# EasyEDA Pro project 学期项目.epro, board PCB4
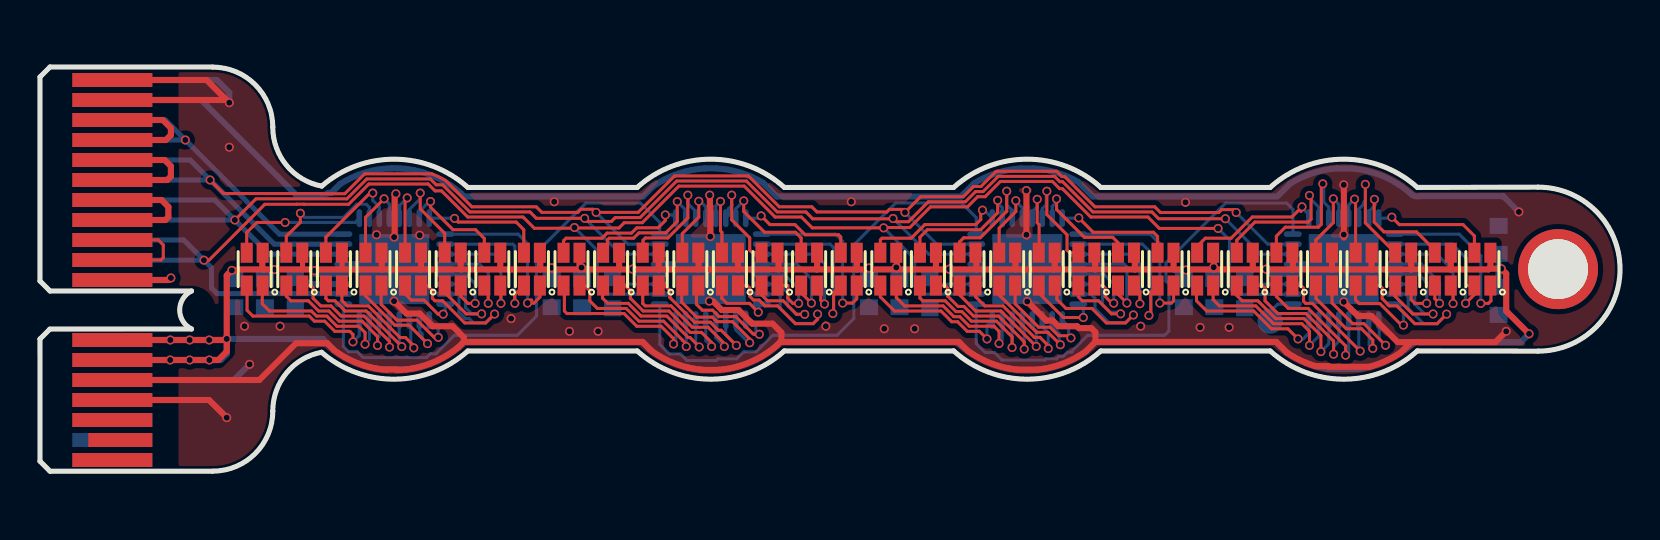
[diagram p9: board, top side]
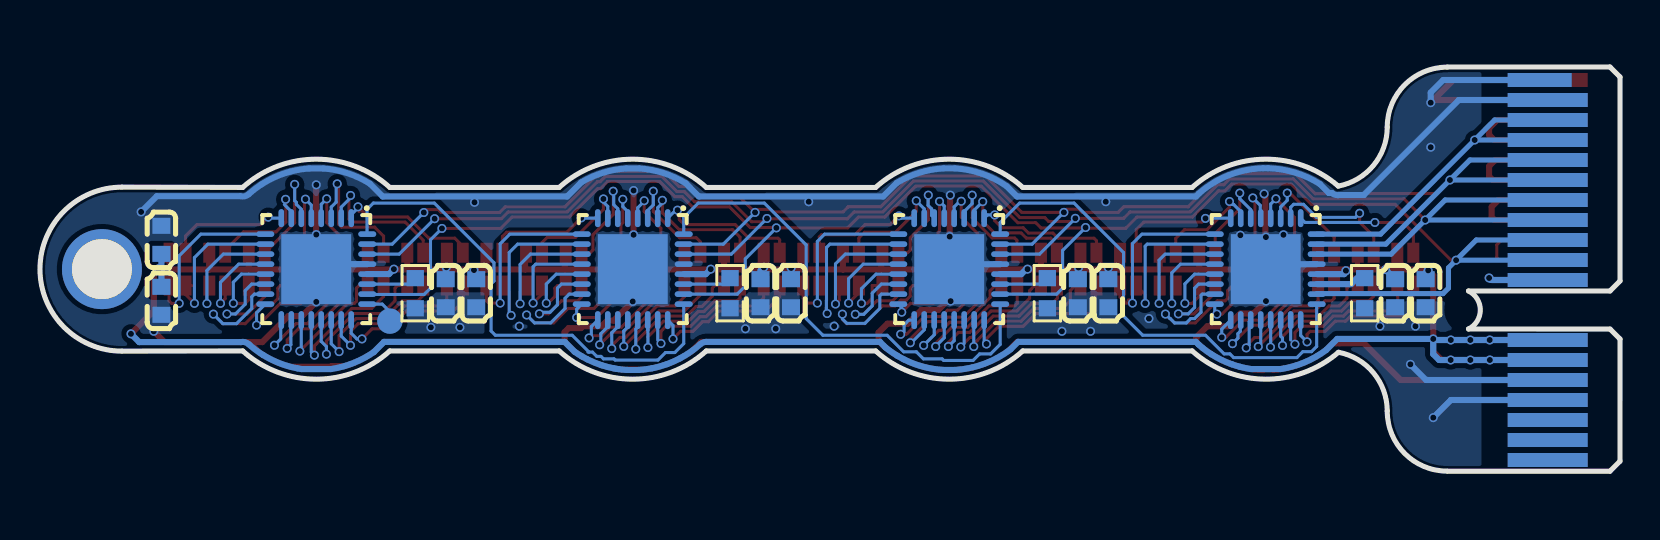
[diagram p10: board, bottom side, seen from below]

Outline 79.05 x 20.21 mm; copper layers: Top Layer, Bottom Layer. Coordinates in mm from the lower left corner of the outline.
Outline path: 8.65,20.2 arc(10.77,19.33) 11.65,17.2 arc(12.33,15.3) 14.1,14.26 arc(17.77,15.6) 21.41,14.19 29.88,14.19 arc(33.56,15.6) 37.24,14.19 45.71,14.19 arc(49.39,15.6) 53.07,14.19 61.54,14.19 arc(65.22,15.6) 68.9,14.19 74.95,14.2 arc(79.05,10.1) 74.95,6 68.9,6.02 arc(65.22,4.6) 61.54,6.02 53.07,6.02 arc(49.39,4.6) 45.71,6.02 37.24,6.02 arc(33.56,4.6) 29.88,6.02 21.41,6.02 arc(17.77,4.6) 14.09,5.95 arc(12.32,4.9) 11.65,3 arc(10.77,0.88) 8.65,0
Stack: Top Layer 0.035mm / Dielectric1 1.51mm FR4 er 4.5 / Bottom Layer 0.035mm

## Design rules (mm)
spacing copperThickness1oz (default): track to track 0.102, other pairs 0.152 to 0.3
spacing copperThickness2oz: track to track 0.203, other pairs 0.152 to 0.3
track width copperThickness1oz (default): min 0.127, default 0.254, max 2.54
track width copperThickness2oz: min 0.203, default 0.254, max 2.54
differential pair differentialPair (default): width min 0.127, default 0.254, max 2.54; gap min 0.152, default 0.152
net GND uses copperRegion

## Placement (name value [footprint] x y rotation side)
C1  10uF  [C0603]  27.12 8.9 90 bottom
C2  10uF  [C0603]  25.6 8.9 90 bottom
C3  100nF  [C0603]  43 8.9 90 bottom
C4  100nF  [C0603]  41.47 8.9 90 bottom
C5  10uF  [C0603]  57.22 8.9 90 bottom
C6  10uF  [C0603]  58.75 8.9 90 bottom
C7  100nF  [C0603]  9.72 8.9 90 bottom
C8  100nF  [C0603]  11.25 8.9 90 bottom
C9  10uF  [C0603]  72.97 8.52 90 bottom
C10  10uF  [C0603]  72.97 11.57 270 bottom
CEM1  PCIEX16_GOLD  [CEMFULLx16]  3.63 13.26 270 top
LED1  LTST-C19HE1WT-H  [LED-ARRAY-SMD_0603-4P-L1.6-W1.6-BL-RD]  10.74 10.1 90 top
LED2  LTST-C19HE1WT-H  [LED-ARRAY-SMD_0603-4P-L1.6-W1.6-BL-RD]  12.72 10.1 90 top
LED3  LTST-C19HE1WT-H  [LED-ARRAY-SMD_0603-4P-L1.6-W1.6-BL-RD]  14.7 10.1 90 top
LED4  LTST-C19HE1WT-H  [LED-ARRAY-SMD_0603-4P-L1.6-W1.6-BL-RD]  16.69 10.1 90 top
LED5  LTST-C19HE1WT-H  [LED-ARRAY-SMD_0603-4P-L1.6-W1.6-BL-RD]  18.67 10.1 90 top
LED6  LTST-C19HE1WT-H  [LED-ARRAY-SMD_0603-4P-L1.6-W1.6-BL-RD]  20.65 10.1 90 top
LED7  LTST-C19HE1WT-H  [LED-ARRAY-SMD_0603-4P-L1.6-W1.6-BL-RD]  22.63 10.1 90 top
LED8  LTST-C19HE1WT-H  [LED-ARRAY-SMD_0603-4P-L1.6-W1.6-BL-RD]  24.61 10.1 90 top
LED9  LTST-C19HE1WT-H  [LED-ARRAY-SMD_0603-4P-L1.6-W1.6-BL-RD]  26.59 10.1 90 top
LED10  LTST-C19HE1WT-H  [LED-ARRAY-SMD_0603-4P-L1.6-W1.6-BL-RD]  28.57 10.1 90 top
LED11  LTST-C19HE1WT-H  [LED-ARRAY-SMD_0603-4P-L1.6-W1.6-BL-RD]  30.55 10.1 90 top
LED12  LTST-C19HE1WT-H  [LED-ARRAY-SMD_0603-4P-L1.6-W1.6-BL-RD]  32.53 10.1 90 top
LED13  LTST-C19HE1WT-H  [LED-ARRAY-SMD_0603-4P-L1.6-W1.6-BL-RD]  34.52 10.1 90 top
LED14  LTST-C19HE1WT-H  [LED-ARRAY-SMD_0603-4P-L1.6-W1.6-BL-RD]  36.5 10.1 90 top
LED15  LTST-C19HE1WT-H  [LED-ARRAY-SMD_0603-4P-L1.6-W1.6-BL-RD]  38.48 10.1 90 top
LED16  LTST-C19HE1WT-H  [LED-ARRAY-SMD_0603-4P-L1.6-W1.6-BL-RD]  40.46 10.1 90 top
LED17  LTST-C19HE1WT-H  [LED-ARRAY-SMD_0603-4P-L1.6-W1.6-BL-RD]  42.44 10.1 90 top
LED18  LTST-C19HE1WT-H  [LED-ARRAY-SMD_0603-4P-L1.6-W1.6-BL-RD]  44.42 10.1 90 top
LED19  LTST-C19HE1WT-H  [LED-ARRAY-SMD_0603-4P-L1.6-W1.6-BL-RD]  46.4 10.1 90 top
LED20  LTST-C19HE1WT-H  [LED-ARRAY-SMD_0603-4P-L1.6-W1.6-BL-RD]  48.39 10.1 90 top
LED21  LTST-C19HE1WT-H  [LED-ARRAY-SMD_0603-4P-L1.6-W1.6-BL-RD]  50.37 10.1 90 top
LED22  LTST-C19HE1WT-H  [LED-ARRAY-SMD_0603-4P-L1.6-W1.6-BL-RD]  52.35 10.1 90 top
LED23  LTST-C19HE1WT-H  [LED-ARRAY-SMD_0603-4P-L1.6-W1.6-BL-RD]  54.33 10.1 90 top
LED24  LTST-C19HE1WT-H  [LED-ARRAY-SMD_0603-4P-L1.6-W1.6-BL-RD]  56.31 10.1 90 top
LED25  LTST-C19HE1WT-H  [LED-ARRAY-SMD_0603-4P-L1.6-W1.6-BL-RD]  58.29 10.1 90 top
LED26  LTST-C19HE1WT-H  [LED-ARRAY-SMD_0603-4P-L1.6-W1.6-BL-RD]  60.27 10.1 90 top
LED27  LTST-C19HE1WT-H  [LED-ARRAY-SMD_0603-4P-L1.6-W1.6-BL-RD]  62.25 10.1 90 top
LED28  LTST-C19HE1WT-H  [LED-ARRAY-SMD_0603-4P-L1.6-W1.6-BL-RD]  64.24 10.1 90 top
LED29  LTST-C19HE1WT-H  [LED-ARRAY-SMD_0603-4P-L1.6-W1.6-BL-RD]  66.22 10.1 90 top
LED30  LTST-C19HE1WT-H  [LED-ARRAY-SMD_0603-4P-L1.6-W1.6-BL-RD]  68.2 10.1 90 top
LED31  LTST-C19HE1WT-H  [LED-ARRAY-SMD_0603-4P-L1.6-W1.6-BL-RD]  70.18 10.1 90 top
LED32  LTST-C19HE1WT-H  [LED-ARRAY-SMD_0603-4P-L1.6-W1.6-BL-RD]  72.16 10.1 90 top
NOREF  -  [Pad_e200]  75.95 10.1 0 top
NOREF#2  -  [Pad_e1118]  61.54 7.5 0 top
R1  10K  [R0603]  28.65 8.9 270 bottom
R2  10K  [R0603]  12.77 8.9 270 bottom
R3  10K  [R0603]  44.52 8.9 270 bottom
R4  10K  [R0603]  60.27 8.9 270 bottom
U1  TLC5947RHBR  [VFQFN-32_L5.0-W5.0-P0.50-TL-EP3.5]  17.73 10.1 270 bottom
U2  TLC5947RHBR  [VFQFN-32_L5.0-W5.0-P0.50-TL-EP3.5]  33.56 10.1 270 bottom
U3  TLC5947RHBR  [VFQFN-32_L5.0-W5.0-P0.50-TL-EP3.5]  49.39 10.1 270 bottom
U4  TLC5947RHBR  [VFQFN-32_L5.0-W5.0-P0.50-TL-EP3.5]  65.22 10.1 270 bottom

## Footprints (pads in the part's own frame, mm; a bottom-side part is the same pattern mirrored in y, then rotated)
C0603
  rect 0.8x0.9 smd: 1(-0.7,0) 2(0.7,0)
CEMFULLx16
  rect 0.7x3.2 smd far side: A1(-6.297,0.39)
  rect 0.7x4 smd far side: A2(-5.297,-0.01) A3(-4.297,-0.01) A4(-3.297,-0.01) A5(-2.297,-0.01) A6(-1.297,-0.01) A7(-0.297,-0.01) A8(0.703,-0.01) A9(1.703,-0.01) A10(2.703,-0.01) A11(3.703,-0.01) A12(6.703,-0.01) A13(7.703,-0.01) A14(8.703,-0.01) A15(9.703,-0.01) A16(10.703,-0.01) A17(11.703,-0.01) A18(12.703,-0.01)
  rect 0.7x4 smd: B1(-6.297,-0.01) B2(-5.297,-0.01) B3(-4.297,-0.01) B4(-3.297,-0.01) B5(-2.297,-0.01) B6(-1.297,-0.01) B7(-0.297,-0.01) B8(0.703,-0.01) B9(1.703,-0.01) B10(2.703,-0.01) B11(3.703,-0.01) B12(6.703,-0.01) B13(7.703,-0.01) B14(8.703,-0.01) B15(9.703,-0.01) B16(10.703,-0.01) B18(12.703,-0.01)
  rect 0.7x3.2 smd: B17(11.703,0.39)
LED-ARRAY-SMD_0603-4P-L1.6-W1.6-BL-RD
  rect 1x0.6 smd: 1(-0.82,-0.4) 2(-0.82,0.4) 3(0.82,0.4) 4(0.82,-0.4)
Pad_e200
  round 4 hole 3: 1(0,0)
Pad_e1118
  round 1.27 smd far side: 1(0,0)
R0603
  rect 0.806x0.864 smd: 1(-0.753,0) 2(0.753,0)
VFQFN-32_L5.0-W5.0-P0.50-TL-EP3.5
  oval 0.9x0.28 smd: 1(-2.55,1.75) 2(-2.55,1.25) 3(-2.55,0.75) 4(-2.55,0.249) 5(-2.55,-0.249) 6(-2.55,-0.75) 7(-2.55,-1.25) 8(-2.55,-1.75) 17(2.55,-1.75) 18(2.55,-1.25) 19(2.55,-0.75) 20(2.55,-0.249) 21(2.55,0.249) 22(2.55,0.75) 23(2.55,1.25) 24(2.55,1.75)
  oval 0.28x0.9 smd: 9(-1.75,-2.55) 10(-1.25,-2.55) 11(-0.75,-2.55) 12(-0.249,-2.55) 13(0.249,-2.55) 14(0.75,-2.55) 15(1.25,-2.55) 16(1.75,-2.55) 25(1.75,2.55) 26(1.25,2.55) 27(0.75,2.55) 28(0.249,2.55) 29(-0.249,2.55) 30(-0.75,2.55) 31(-1.25,2.55) 32(-1.75,2.55)
  rect 3.5x3.5 smd: 33(0.001,-0.001)

## Nets
As in the schematic.

Pads without a net: CEM1 A16 A17 A18 B16 B17 B18; NOREF 1; NOREF#2 1; U4 25

## Via types
v1: diameter 0.45, hole 0.305, Top Layer to Bottom Layer, 159 vias
v2: diameter 0.45, hole 0.3, Top Layer to Bottom Layer, 6 vias

## Routing (per net, layer and track width the routed paths; a pad name or vN(x,y) marks a point on that pad's centre or on a via; arc(x,y) is an arc through that point)
GND: length 222.1
  Top Layer w0.305: 52.8,6.47 61.85,6.47 62.39,5.92 arc(62.85,5.65) 63.34,5.42 arc(63.57,5.33) 63.82,5.25 64.46,5.25 64.49,5.22 66.52,5.22 arc(67.32,5.51) 68.05,5.92 68.59,6.46 ; 52.8,6.47 52.33,6 arc(52.13,5.86) 51.92,5.73 arc(51.06,5.34) 50.15,5.11 arc(50.03,5.1) 49.92,5.08 48.87,5.08 arc(47.57,5.39) 46.4,6.04 45.97,6.47 37.05,6.47 ; 52.8,6.47 52.8,6.95 52.6,7.16 51.98,7.16 51.88,7.25 50.95,7.25 50.66,7.53 50.35,7.53 v1(49.39,8.49) ; v1(33.49,8.5) 33.67,8.5 34.11,8.06 34.95,8.06 35.63,7.38 36.65,7.38 37.09,6.93 37.09,6.51 37.05,6.47 ; CEM1.B1 8.34,19.56 9.34,18.56 CEM1.A2 ; 21.2,6.47 20.95,6.22 arc(20.45,5.86) 19.91,5.55 arc(19.73,5.47) 19.54,5.39 arc(19.13,5.25) 18.7,5.15 arc(18.52,5.12) 18.33,5.09 arc(18.09,5.07) 17.85,5.06 ; 21.2,6.47 21.2,6.7 20.65,7.25 19.63,7.25 19,7.89 18.33,7.89 v1(17.71,8.51) ; 21.2,6.47 30.15,6.47 30.62,6 arc(31.46,5.51) 32.39,5.19 arc(32.7,5.13) 33.03,5.08 arc(33.1,5.08) 33.16,5.07 33.95,5.07 arc(35.52,5.45) 36.88,6.3 37.05,6.47 ; CEM1.A15 8.46,3.56 v1(9.34,2.68) ; v1(17.81,13.87) 17.74,13.81 17.74,11.73 v1(17.72,11.71) ; v1(65.22,8.47) 65.93,7.76 66.62,7.76 67.92,6.46 68.81,6.46 arc(68.9,6.47) 69,6.46 72.81,6.46 v1(73.35,7) ; v1(49.35,14.04) v1(49.35,11.82) ; v1(33.54,11.73) 33.54,13.25 33.51,13.27 33.51,13.79 v1(33.5,13.8) ; v1(65.22,14.32) 65.23,14.31 65.23,11.69 ; CEM1.A14 10.97,4.56 12.81,6.4 14.04,6.4 arc(14.12,6.4) 14.19,6.4 14.37,6.4 14.72,6.04 arc(15.43,5.61) 16.19,5.29 arc(16.34,5.25) 16.49,5.21 arc(16.64,5.17) 16.79,5.14 arc(16.96,5.11) 17.12,5.09 arc(17.24,5.08) 17.36,5.07 ; 17.85,5.09 17.36,5.09
  Bottom Layer w0.305: v1(9.34,2.68) 8.46,3.56 CEM1.A15 ; v1(9.47,18.43) 9.47,18.93 8.84,19.56 4.02,19.56 ; U2.29 33.31,10.35 U2.33 ; U4.29 64.97,10.35 U4.33 ; U1.29 17.48,10.35 U1.33 ; v1(73.99,12.97) 73.2,13.75 69.02,13.75 arc(68.8,13.75) 68.6,13.85 arc(68.29,14.11) 67.97,14.34 arc(67.27,14.72) 66.52,14.98 arc(66.05,15.08) 65.58,15.14 64.87,15.14 arc(63.66,14.9) 62.54,14.37 61.9,13.74 52.67,13.74 51.97,14.44 arc(50.88,14.93) 49.71,15.14 49.07,15.14 arc(47.86,14.91) 46.74,14.4 46.08,13.74 36.86,13.74 36.19,14.41 arc(35.06,14.92) 33.84,15.14 33.28,15.14 arc(31.92,14.88) 30.68,14.25 30.17,13.74 21.22,13.74 21.07,13.88 arc(19.57,14.8) 17.85,15.15 arc(17.73,15.15) 17.6,15.15 arc(16.25,14.93) 15.01,14.36 14.57,13.91 14.41,13.91 arc(14.23,13.82) 14.03,13.81 12.82,13.81 8.07,18.56 CEM1.A2 ; CEM1.A14 9.7,4.56 v1(10.49,5.35)
  vias: v1(9.47,16.2) v1(10.23,7.25) v1(12.01,7.25) v1(16.84,11.82) v1(19,11.8) v1(23.57,7.63) v1(25.73,13.47) v1(26.49,7) v1(27.92,7) v1(39.32,7.25) v1(40.59,13.47) v1(42.24,7.12) v1(43.76,7.12) v1(55.06,7.25) v1(57.31,13.45) v1(58.04,7.19) v1(59.49,7.19) v1(65.22,11.83)
(no net): length 1.8
  Bottom Layer w0.152: U4.25 61.92,8.35 61.54,7.97 NOREF#2.1
BLANK: length 86.9
  Top Layer w0.152: v1(59.3,12.63) 55.96,12.63 55.62,12.96 52.67,12.96 51.16,14.48 51.02,14.48 50.76,14.74 47.94,14.74 47.18,13.98 46.81,13.98 46.3,13.47 44.45,13.47 43.45,12.48 42.84,12.48 ; v1(42.68,12.64) 42.66,12.62 38.66,12.62 38.31,12.97 36.88,12.97 35.34,14.51 31.85,14.51 30.02,12.68 28.78,12.68 28.59,12.49 27.41,12.49 v1(27.25,12.64) 24.83,12.64 24.51,12.97 21.5,12.97 20.15,14.32 19.82,14.32 19.53,14.62 16.35,14.62 15.35,13.62 10.81,13.62 v1(9.75,12.56)
  Bottom Layer w0.152: v1(59.3,12.63) 61.07,10.85 U4.30 ; v1(27.25,12.64) 29.04,10.85 U2.30 ; v1(42.68,12.64) 44.46,10.85 U3.30
  Bottom Layer w0.254: U1.30 11.46,10.85 v1(9.75,12.56) ; v1(9.75,12.56) 8.75,13.56 CEM1.A7 ; v1(9.75,12.56) CEM1.A8
DATA: length 17.6
  Bottom Layer w0.254: CEM1.A4 v1(7.27,16.56) ; v1(7.27,16.56) 6.27,17.56 CEM1.A3 ; v1(7.27,16.56) 11.98,11.85 U1.32
IO3: length 86.1
  Top Layer w0.152: v1(8.51,14.56) 9.19,13.88 14.04,13.88 14.05,13.87 15.25,13.87 16.24,14.87 19.6,14.87 arc(19.95,14.72) 20.29,14.54 21.61,13.22 24.83,13.22 25.11,12.94 26.91,12.94 27.06,13.1 27.67,13.1 v1(27.82,12.94) 29.93,12.94 31.75,14.77 35.44,14.77 36.99,13.22 38.61,13.22 38.87,12.97 42.36,12.97 42.49,13.09 43.12,13.09 v1(43.27,12.94) 44.06,13.73 46.19,13.73 46.7,14.24 47.07,14.24 47.82,14.98 arc(47.85,14.99) 47.88,15 50.86,15 51.13,14.73 51.27,14.73 52.78,13.22 55.77,13.22 56.05,12.94 58.97,12.94 59.12,13.08 59.7,13.08 v1(59.84,12.94)
  Bottom Layer w0.152: U3.31 44.86,11.35 v1(43.27,12.94) ; U2.31 29.41,11.35 v1(27.82,12.94) ; U4.31 61.43,11.35 v1(59.84,12.94)
  Bottom Layer w0.254: CEM1.A5 7.51,15.56 v1(8.51,14.56) ; U1.31 11.72,11.35 v1(8.51,14.56) ; v1(8.51,14.56) CEM1.A6
IO7: length 6.5
  Top Layer w0.305: CEM1.B4 6.3,16.56 6.55,16.82 6.55,17.16 6.14,17.56 CEM1.B3
IO9: length 6.6
  Top Layer w0.305: CEM1.B6 6.37,14.56 6.55,14.74 6.55,15.25 6.24,15.56 CEM1.B5
IO11: length 94.8
  Top Layer w0.152: v1(58.94,12.14) 56,12.14 55.43,12.71 52.57,12.71 51.15,14.13 51.01,14.13 50.65,14.49 48.05,14.49 47.28,13.73 46.91,13.73 46.4,13.22 44.55,13.22 43.52,12.18 42.22,12.18 v1(42.21,12.17) 38.64,12.17 38.09,12.71 36.78,12.71 35.23,14.26 31.96,14.26 30.13,12.43 29.23,12.43 28.96,12.16 26.76,12.16 v1(26.74,12.19) ; v1(8.2,10.55) 8.45,10.55 11.25,13.35 12.83,13.35 12.84,13.35 13.21,13.35 13.22,13.35 15.44,13.35 16.45,14.36 19.42,14.36 19.77,14.02 20.09,14.02 21.4,12.71 24.17,12.71 24.73,12.15 26.74,12.15
  Bottom Layer w0.152: v1(58.94,12.14) 59.51,11.57 59.51,9.16 59.83,8.84 62.66,8.84 U4.26 ; v1(42.21,12.17) 43.76,10.61 43.76,9.26 44.16,8.85 U3.26 ; v1(26.74,12.19) 27.89,11.04 27.89,9.16 28.19,8.85 U2.26
  Bottom Layer w0.254: v1(8.2,10.55) 3.63,10.55 CEM1.A10 ; v1(8.2,10.55) 7.19,11.56 CEM1.A9 ; v1(8.2,10.55) 8.58,10.17 8.58,9.16 8.86,8.88 15.15,8.88 U1.26
IO12: length 5.9
  Top Layer w0.152: CEM1.B10 6.05,10.56 6.17,10.68 6.17,11.31 5.91,11.57 3.63,11.57 CEM1.B9
IO21: length 5.9
  Top Layer w0.305: CEM1.A11 6.45,9.56 v1(6.55,9.66)
  Bottom Layer w0.305: v1(6.55,9.66) 6.45,9.56 CEM1.A11
LIGHTVCC: length 203.1
  Top Layer w0.254: LED3.4 15.11,10.91 15.11,10.09 ; LED2.4 13.13,10.91 13.13,10.09
  Top Layer w0.305: 58.72,10.09 60.65,10.09 ; 58.72,10.09 56.74,10.09 ; 58.72,10.09 58.72,10.9 LED25.4 ; 60.65,10.09 60.67,10.11 LED26.4 ; 60.65,10.09 62.68,10.09 ; 48.8,10.09 50.72,10.09 ; 48.8,10.09 46.85,10.09 ; 48.8,10.09 48.8,10.91 LED20.4 ; 50.72,10.09 52.79,10.09 ; 50.72,10.09 50.77,10.14 LED21.4 ; 68.61,10.09 68.6,10.1 LED30.4 ; 68.61,10.09 70.57,10.09 ; 68.61,10.09 66.63,10.09 ; 26.99,10.09 26.99,10.09 LED9.4 ; 26.99,10.09 30.97,10.09 ; 26.99,10.09 25.03,10.09 ; LED11.4 30.95,10.1 30.97,10.09 ; 62.68,10.09 62.68,10.9 LED27.4 ; 62.68,10.09 64.63,10.09 ; 56.74,10.09 54.77,10.09 ; 56.74,10.09 56.71,10.12 LED24.4 ; 40.87,10.09 40.87,10.91 LED16.4 ; 40.87,10.09 38.87,10.09 ; 40.87,10.09 42.87,10.09 ; 23.03,10.09 25.03,10.09 ; 23.03,10.09 23.03,10.1 23.03,10.92 ; 23.03,10.09 21.09,10.09 ; 25.03,10.09 25.03,10.91 LED8.4 ; LED5.4 19.07,10.1 19.05,10.09 ; LED17.4 42.87,10.9 42.87,10.09 ; 72.5,10.13 v1(73.11,10.13) 73.35,9.88 73.35,8.01 v1(74.5,6.87) ; 72.5,10.13 72.56,10.19 LED32.4 ; 72.5,10.13 72.46,10.09 70.57,10.09 ; LED13.4 34.92,10.11 34.94,10.09 ; 9.34,6.58 9.33,6.56 v1(8.47,6.56) v1(7.49,6.56) v1(6.52,6.56) CEM1.A12 ; 9.34,6.58 9.34,5.98 8.92,5.56 v1(8.47,5.56) v1(7.49,5.56) v1(6.51,5.56) CEM1.A13 ; 9.34,6.58 9.34,9.79 v1(9.6,10.04) ; 38.87,10.09 36.95,10.09 ; 38.87,10.09 38.88,10.1 LED15.4 ; 36.95,10.09 36.95,10.87 LED14.4 ; 36.95,10.09 34.94,10.09 ; 54.77,10.09 54.77,10.88 LED23.4 ; 54.77,10.09 52.79,10.09 ; LED29.4 66.62,10.11 66.63,10.09 ; 19.05,10.09 21.09,10.09 ; 19.05,10.09 17.1,10.09 ; 46.85,10.09 44.85,10.09 ; 46.85,10.09 46.85,10.88 LED19.4 ; 64.63,10.09 64.64,10.1 LED28.4 ; 64.63,10.09 66.63,10.09 ; LED1.4 11.12,10.91 11.12,10.17 11.2,10.09 ; 30.97,10.09 32.95,10.09 ; 34.94,10.09 32.95,10.09 ; LED18.4 44.82,10.12 44.85,10.09 ; 44.85,10.09 42.87,10.09 ; 11.2,10.09 9.88,10.09 9.82,10.02 9.6,10.02 ; 11.2,10.09 17.1,10.09 ; 52.79,10.09 52.79,10.89 LED22.4 ; 32.95,10.09 32.95,10.91 LED12.4 ; LED31.4 70.58,10.1 70.57,10.09 ; 21.09,10.09 21.05,10.13 LED6.4 ; 17.1,10.09 17.1,10.91 LED4.4 ; LED10.4 28.97,10.09
  Bottom Layer w0.305: 29.67,10.14 29.95,9.86 U2.28 ; U3.28 45.74,9.86 v1(45.49,10.1) ; C5.2 57.33,9.71 v1(57.33,10.06) ; v1(27.09,10.18) 27.12,10.15 C1.2 ; v1(74.5,6.87) 74.08,6.46 69,6.46 arc(68.79,6.45) 68.6,6.35 arc(68.26,6.07) 67.89,5.81 arc(67.06,5.4) 66.17,5.14 arc(66.07,5.13) 65.97,5.11 64.48,5.11 arc(63.36,5.41) 62.34,5.96 61.83,6.47 52.79,6.47 52.3,5.98 arc(52.12,5.85) 51.93,5.74 arc(51.8,5.67) 51.66,5.59 arc(51.32,5.44) 50.96,5.3 arc(50.66,5.22) 50.36,5.15 arc(50.29,5.13) 50.21,5.12 arc(50.16,5.11) 50.1,5.1 arc(49.89,5.08) 49.68,5.06 49.1,5.06 arc(48.76,5.09) 48.42,5.15 arc(48.04,5.24) 47.67,5.36 arc(47.34,5.49) 47.03,5.64 arc(46.5,5.97) 46.01,6.35 arc(45.87,6.44) 45.71,6.47 37.02,6.47 36.74,6.18 arc(36.46,5.97) 36.16,5.78 arc(36,5.68) 35.83,5.59 arc(34.86,5.23) 33.84,5.06 33.28,5.06 arc(31.8,5.37) 30.49,6.1 30.11,6.47 ; CEM1.A12 v1(6.52,6.56) v1(7.49,6.56) v1(8.47,6.56) 9.29,6.56 v1(9.34,6.62) ; v1(42.84,10.19) 43,10.03 C3.2 ; v1(9.6,10.04) 9.72,9.92 C7.2 ; 13.67,9.98 13.8,9.86 U1.28 ; 30.11,6.47 21.22,6.47 21.08,6.33 arc(20.98,6.24) 20.87,6.15 arc(20.66,6) 20.45,5.85 arc(19.95,5.57) 19.42,5.35 arc(19.22,5.28) 19.02,5.22 arc(18.74,5.16) 18.47,5.11 16.99,5.11 arc(15.78,5.44) 14.7,6.06 14.15,6.62 v1(9.34,6.62) ; v1(41.47,10.16) 41.47,9.61 C4.2 ; C9.2 C10.2 ; C2.2 v1(25.6,10.17) ; v1(9.34,6.62) 9.34,5.85 9.05,5.56 v1(8.47,5.56) v1(7.49,5.56) v1(6.51,5.56) CEM1.A13 ; C8.2 v1(11.73,10.08) ; U4.28 61.59,9.86 v1(61.34,10.1) ; v1(58.72,10.2) 58.75,10.17 C6.2
  vias: v1(13.71,10.03) v1(29.64,10.1)
U1_IREF: length 2.1
  Bottom Layer w0.305: 13.15,9.66 13.45,9.35 U1.27
U1_OUT0: length 6.9
  Top Layer w0.152: LED1.3 10.34,11.93 10.85,12.44 v2(12.27,12.44)
  Bottom Layer w0.152: v2(12.27,12.44) 15.76,12.44 U1.1
U1_OUT1: length 6.7
  Top Layer w0.152: v2(13.03,12.9) 13.03,12.45 12.49,11.91 12.47,11.91 12.32,11.75 LED2.3
  Bottom Layer w0.152: U1.2 16.48,13.2 16.33,13.35 15.84,13.35 15.18,12.69 13.23,12.69 v2(13.03,12.9)
U1_OUT2: length 5.4
  Top Layer w0.152: v2(16.65,13.91) 16.51,13.91 14.3,11.7 LED3.3
  Bottom Layer w0.152: v2(16.65,13.91) 16.65,13.54 16.98,13.21 U1.3
U1_OUT3: length 4.2
  Top Layer w0.152: v2(17.21,13.62) 16.28,12.69 LED4.3
  Bottom Layer w0.152: v2(17.21,13.62) 17.48,13.36 U1.4
U1_OUT4: length 4
  Top Layer w0.152: v2(18.37,13.67) 18.27,13.56 LED5.3
  Bottom Layer w0.152: U1.5 18,12.68 18,13.29 v2(18.37,13.67)
U1_OUT5: length 5
  Top Layer w0.152: LED6.3 20.25,11.9 19.02,13.12 v2(19.02,13.91)
  Bottom Layer w0.152: U1.6 18.48,13.08 19.02,13.63 v2(19.02,13.91)
U1_OUT6: length 5.4
  Top Layer w0.152: LED7.3 22.23,11.64 21.79,12.08 20.66,12.08 19.54,13.2 v1(19.54,13.49)
  Bottom Layer w0.152: U1.7 18.98,12.98 19.32,13.33 19.38,13.33 v1(19.54,13.49)
U1_OUT7: length 6.1
  Top Layer w0.152: v1(20.74,12.64) 20.92,12.46 23.82,12.46 24.2,12.08 24.2,10.93 LED8.3
  Bottom Layer w0.152: v1(20.74,12.64) 20.73,12.65 U1.8
U1_OUT8: length 8.8
  Top Layer w0.152: v1(24.39,8.41) 24.71,8.41 25.01,8.71 25.01,8.96 ; 24.6,8.56 24.54,8.56 24.46,8.48
  Top Layer w0.305: LED8.1 25.01,9.03 ; 24.46,8.48 v1(24.39,8.41)
  Bottom Layer w0.152: U1.9 23.92,11.85 24.39,11.38 v1(24.39,8.41)
U1_OUT9: length 7.5
  Top Layer w0.152: v1(23.76,8.39) 23.76,8.83 LED8.2
  Bottom Layer w0.152: U1.10 23.66,11.35 23.76,11.25 v1(23.76,8.39)
U1_OUT10: length 6
  Top Layer w0.152: 23.03,9.28 23.06,9.25 v1(23.06,8.39)
  Bottom Layer w0.152: U1.11 22.76,10.85 23.06,10.55 v1(23.06,8.39)
U1_OUT11: length 4.8
  Top Layer w0.152: v1(22.43,8.39) 22.43,9.09 LED7.2
  Bottom Layer w0.152: U1.12 21.99,10.35 22.43,9.92 v1(22.43,8.39)
U1_OUT12: length 4.1
  Top Layer w0.152: v1(21.77,8.39) 21.41,8.39 21.05,8.75 LED6.1
  Bottom Layer w0.152: v1(21.77,8.39) 21.77,9.37 21.28,9.86 U1.13
U1_OUT13: length 5.6
  Top Layer w0.152: LED6.2 20.25,8.94 21.32,7.87 v1(22.09,7.87)
  Bottom Layer w0.152: v1(22.09,7.87) 21.6,7.87 21.28,8.19 21.28,9.16 21.08,9.35 U1.14
U1_OUT14: length 8.6
  Top Layer w0.152: LED5.1 19.37,9.28 19.63,9.03 19.63,8.65 19.76,8.52 20.15,8.52 21.25,7.41 22.3,7.41 v1(22.74,7.86)
  Bottom Layer w0.152: U1.15 20.9,8.85 20.96,8.79 20.96,7.95 21.28,7.63 21.48,7.63 21.7,7.41 22.28,7.41 22.5,7.63 22.51,7.63 v1(22.74,7.86)
U1_OUT15: length 3.3
  Top Layer w0.152: LED5.2 18.27,8.87 18.58,8.56 19.21,8.56 19.91,7.85 v1(20.17,7.85)
  Bottom Layer w0.152: v1(20.17,7.85) 20.28,7.96 U1.16
U1_OUT16: length 5.5
  Top Layer w0.152: LED4.1 17.07,9.27 17.07,8.34 17.86,7.55 18.86,7.55 19.72,6.69 v1(19.93,6.69)
  Bottom Layer w0.152: U1.17 19.93,7.1 v1(19.93,6.69)
U1_OUT17: length 6
  Top Layer w0.152: v1(19.39,6.38) 18.47,7.3 17.75,7.3 16.28,8.77 LED4.2
  Bottom Layer w0.152: U1.18 19,7.53 19,7 19.12,6.88 19.12,6.65 v1(19.39,6.38)
U1_OUT18: length 7.2
  Top Layer w0.152: 15.44,9.28 LED3.1 15.1,8.54 15.37,8.27 16.43,8.27 18.01,6.68 18.29,6.68 18.7,6.27 v1(18.7,6.17)
  Bottom Layer w0.152: v1(18.7,6.17) 18.55,6.31 18.55,7.48 U1.19
U1_OUT19: length 6.8
  Top Layer w0.152: v1(18.1,6.23) 18.1,6.24 16.32,8.01 15.27,8.01 14.76,8.52 14.42,8.52 14.3,8.64 LED3.2
  Bottom Layer w0.152: U1.20 17.97,6.35 v1(18.1,6.23)
U1_OUT20: length 7.5
  Top Layer w0.152: v1(17.49,6.21) 17.49,6.49 16.22,7.76 15.07,7.76 14.56,8.27 14.04,8.27 13.66,8.65 13.66,9.16 13.53,9.28 LED2.1
  Bottom Layer w0.152: v1(17.49,6.21) 17.48,6.22 U1.21
U1_OUT21: length 7.7
  Top Layer w0.152: LED2.2 12.32,8.75 12.55,8.52 13.43,8.52 13.94,8.01 14.45,8.01 14.96,7.5 16.11,7.5 16.89,6.73 v1(16.89,6.29)
  Bottom Layer w0.152: U1.22 16.98,6.75 16.89,6.66 v1(16.89,6.29)
U1_OUT22: length 8.2
  Top Layer w0.152: v1(16.26,6.35) 16.26,6.94 15.95,7.25 14.86,7.25 14.35,7.76 13.83,7.76 13.58,8.01 11.48,8.01 11.12,8.37 11.12,9.27 LED1.1
  Bottom Layer w0.152: U1.23 16.48,6.56
U1_OUT23: length 8.6
  Top Layer w0.152: LED1.2 10.36,9.27 10.36,8.05 10.65,7.76 13.47,7.76 13.73,7.5 14.24,7.5 14.75,6.99 15.5,6.99 15.66,6.84 v1(15.66,6.47)
  Bottom Layer w0.152: U1.24 15.98,6.79 v1(15.66,6.47)
U1_SOUT: length 24.2
  Bottom Layer w0.152: U2.32 31.01,12.44 30.04,13.41 27.31,13.41 24.84,10.93 24.84,8.6 24.84,8.6 24.84,7.76 23.88,6.8 20.73,6.8 19.8,5.87 19.52,5.87 19.33,5.68 16.17,5.68 15.87,5.98 15.44,5.98 15.18,6.24 U1.25
U2_IREF: length 2.5
  Bottom Layer w0.152: R1.1 28.95,9.35 U2.27
U2_OUT: length 24.7
  Bottom Layer w0.152: U3.32 46.84,12.68 46.11,13.41 42.81,13.41 40.71,11.31 40.71,7.63 39.88,6.8 36.66,6.8 35.84,5.97 35.2,5.97 34.85,5.62 33.91,5.62 33.83,5.54 32.37,5.54 32.04,5.86 31.49,5.86 31.01,6.34 U2.25
U2_OUT0: length 7
  Top Layer w0.152: LED9.3 26.19,11.52 26.32,11.65 28.12,11.65 28.37,11.91 29.59,11.91 29.86,12.17 30.92,12.17 31.28,12.53 v1(31.28,12.81)
  Bottom Layer w0.152: v1(31.28,12.81) 31.65,12.81 U2.1
U2_OUT1: length 6.6
  Top Layer w0.152: LED10.3 28.39,11.15 28.39,11.57 28.48,11.65 29.7,11.65 29.96,11.92 31.31,11.92 31.88,12.5 v1(31.88,13.48)
  Bottom Layer w0.152: U2.2 32.31,13.05 v1(31.88,13.48)
U2_OUT2: length 5.8
  Top Layer w0.152: LED11.3 30.17,10.94 30.17,11.55 30.29,11.66 31.41,11.66 32.41,12.66 v1(32.41,13.8)
  Bottom Layer w0.152: v1(32.41,13.8) 32.41,13.38 32.81,12.98 U2.3
U2_OUT3: length 3.9
  Top Layer w0.152: LED12.3 32.13,11.88 32.96,12.7 v1(32.96,13.5)
  Bottom Layer w0.152: v1(32.96,13.5) 33.03,13.5 33.31,13.22 U2.4
U2_OUT4: length 3.5
  Top Layer w0.152: LED13.3 34.12,11.94 34.04,12.02 v1(34.04,13.49)
  Bottom Layer w0.152: U2.5 33.81,13.26 34.03,13.49 v1(34.04,13.49)
U2_OUT5: length 5
  Top Layer w0.152: LED14.3 36.09,10.93 35.63,10.93 35.51,11.06 35.51,11.67 34.61,12.57 v1(34.61,13.8)
  Bottom Layer w0.152: U2.6 34.44,12.79 34.44,13.12 34.62,13.29 34.62,13.79 v1(34.61,13.8)
U2_OUT6: length 5.7
  Top Layer w0.152: v1(35.21,13.52) 35.21,12.99 36.25,11.95 37.79,11.95 38.08,11.66 LED15.3
  Bottom Layer w0.152: U2.7 34.81,13.12 v1(35.21,13.52)
U2_OUT7: length 6
  Top Layer w0.152: 40.06,10.93 40.06,11.71 39.95,11.82 38.28,11.82 37.77,12.33 36.52,12.33 v1(36.08,12.77)
  Bottom Layer w0.152: U2.8 35.96,12.65 v1(36.08,12.77)
U2_OUT8: length 8.7
  Top Layer w0.152: v1(40.16,8.41) 40.65,8.41 40.86,8.62 LED16.1
  Bottom Layer w0.152: v1(40.16,8.41) 40.16,11.49 39.79,11.85 36.11,11.85
U2_OUT9: length 8.8
  Top Layer w0.152: LED16.2 39.7,8.93 39.7,7.92 v1(39.67,7.88)
  Bottom Layer w0.152: 39.7,8.17 39.7,8.55 39.7,8.55 39.7,11.19 39.53,11.35 36.11,11.35 ; 39.7,8.17 39.7,7.92 ; 39.7,8.17 39.7,7.92 39.7,7.92 ; 39.7,7.92 v1(39.67,7.88)
U2_OUT10: length 6.4
  Top Layer w0.152: LED15.1 39.06,9.1 39.06,8.55 v1(39.25,8.36)
  Bottom Layer w0.152: v1(39.25,8.36) 39.25,10.36 38.76,10.85 36.11,10.85
U2_OUT11: length 5.1
  Top Layer w0.152: LED15.2 38.08,8.92 v1(38.59,8.41)
  Bottom Layer w0.152: v1(38.59,8.41) 38.59,9.63 37.86,10.35 36.11,10.35
U2_OUT12: length 4.7
  Top Layer w0.152: v1(37.95,8.39) 37.66,8.39 37.41,8.65 37.41,9.28 LED14.1
  Bottom Layer w0.152: v1(37.95,8.39) 37.95,9.12 37.22,9.86 36.11,9.86
U2_OUT13: length 6.2
  Top Layer w0.152: LED14.2 36.1,8.82 36.4,8.52 37.18,8.52 37.85,7.85 v1(38.26,7.85)
  Bottom Layer w0.152: v1(38.26,7.85) 37.83,7.85 37.41,8.27 37.41,8.9 36.96,9.35 36.11,9.35
U2_OUT14: length 8.7
  Top Layer w0.152: LED13.1 35.38,9.28 35.51,9.16 35.51,8.75 35.7,8.56 35.98,8.56 36.27,8.27 36.9,8.27 37.79,7.38 38.68,7.38 38.9,7.6 v1(38.9,7.85)
  Bottom Layer w0.152: 38.9,7.62 38.68,7.39 37.78,7.39 37.03,8.14 37.03,8.77 36.95,8.85 36.59,8.85
U2_OUT15: length 3.2
  Top Layer w0.152: LED13.2 34.11,9.28 34.11,8.65 34.36,8.39 35.49,8.39 v1(35.93,7.95)
  Bottom Layer w0.152: 36.11,8.35 35.93,8.18 v1(35.93,7.95)
U2_OUT16: length 5.7
  Top Layer w0.152: LED12.1 32.84,9.19 32.84,8.35 33.14,8.05 33.65,8.05 33.97,7.73 34.81,7.73 35.66,6.88 35.69,6.88 35.72,6.85 v1(35.99,6.85)
  Bottom Layer w0.152: U2.17 35.58,7.55 35.81,7.32 35.81,6.97
U2_OUT17: length 6.7
  Top Layer w0.152: v1(35.51,6.42) 35.51,6.62 34.64,7.48 33.87,7.48 33.64,7.71 32.85,7.71 32.1,8.45 32.1,9.25 LED12.2
  Bottom Layer w0.152: U2.18 34.81,7.07 35.45,6.42 v1(35.51,6.42)
U2_OUT18: length 6.8
  Top Layer w0.152: v1(34.84,6.29) 34.08,7.05 33.94,7.05 33.53,7.45 32.74,7.45 31.51,8.68 31.51,9.03 31.26,9.28 LED11.1
  Bottom Layer w0.152: v1(34.84,6.29) 34.31,6.82 U2.19
U2_OUT19: length 7.5
  Top Layer w0.152: v1(34.24,6.23) 34.24,6.39 33.43,7.2 32.64,7.2 31.57,8.27 30.28,8.27 30.15,8.39 LED11.2
  Bottom Layer w0.152: U2.20 33.81,6.67 34.24,6.24 v1(34.24,6.23)
U2_OUT20: length 7.7
  Top Layer w0.152: v1(33.6,6.23) 33.6,6.43 33.09,6.94 32.53,6.94 31.46,8.01 30.17,8.01 29.54,8.65 29.54,9.03 29.28,9.28 LED10.1
  Bottom Layer w0.152: v1(33.6,6.23) 33.31,6.53 U2.21
U2_OUT21: length 7.7
  Top Layer w0.152: v1(32.98,6.21) 32.98,6.23 32.52,6.69 32.43,6.69 31.36,7.76 30.07,7.76 29.43,8.39 28.4,8.39 28.14,8.66 28.14,9.25 LED10.2
  Bottom Layer w0.152: U2.22 32.81,6.38
U2_OUT22: length 8.3
  Top Layer w0.152: v1(32.33,6.23) 32.33,6.36 32.15,6.54 32.15,6.55 31.19,7.5 29.96,7.5 29.33,8.14 27.89,8.14 27.5,8.52 27.5,9.03 27.25,9.28 LED9.1
  Bottom Layer w0.152: U2.23 32.33,7.53 v1(32.33,6.23)
U2_OUT23: length 8.8
  Top Layer w0.152: LED9.2 26.23,9.24 26.23,8.01 26.36,7.88 29.22,7.88 29.86,7.25 31.07,7.25 31.7,6.63 v1(31.7,6.36)
  Bottom Layer w0.152: v1(31.7,6.36) 31.81,6.47 U2.24
U3_IREF: length 2.4
  Bottom Layer w0.152: R3.1 44.82,9.35 U3.27
U3_OUT0: length 7.2
  Top Layer w0.152: LED17.3 42.04,11.57 42.12,11.65 43.59,11.65 44.26,12.33 46.81,12.33 47.06,12.58 47.06,12.97 v1(47.15,13.05)
  Bottom Layer w0.152: v1(47.15,13.05) 47.24,13.05 U3.1
U3_OUT1: length 6.8
  Top Layer w0.152: LED18.3 44.02,11.7 44.4,12.08 47.06,12.08 47.91,12.92 v1(47.91,13.55)
  Bottom Layer w0.152: U3.2 48.14,13.18 47.91,13.41 v1(47.91,13.55)
U3_OUT2: length 6
  Top Layer w0.152: v1(48.36,14) 48.36,13 47.04,11.67 46.21,11.67 46,11.46 LED19.3
  Bottom Layer w0.152: v1(48.36,14) 48.36,13.31 48.64,13.04 U3.3
U3_OUT3: length 4
  Top Layer w0.152: LED20.3 47.99,12.15 48.82,12.98 v1(48.82,13.53)
  Bottom Layer w0.152: U3.4 49.14,13.17 48.82,13.49 v1(48.82,13.53)
U3_OUT4: length 3.8
  Top Layer w0.152: LED21.3 49.98,10.94 49.98,12.33 49.89,12.43 v1(49.89,13.6)
  Bottom Layer w0.152: U3.5 49.64,12.98 49.89,13.23 v1(49.89,13.6)
U3_OUT5: length 5.4
  Top Layer w0.152: v1(50.37,14) 50.37,12.83 51.38,11.82 51.38,11.06 51.51,10.93 51.94,10.93 LED22.3
  Bottom Layer w0.152: v1(50.37,14) 50.34,13.97 50.34,13.33 50.14,13.13 50.14,12.65
U3_OUT6: length 5.8
  Top Layer w0.152: v1(50.86,13.61) 50.86,13.09 52.25,11.7 53.67,11.7 53.93,11.43 LED23.3
  Bottom Layer w0.152: U3.7 50.64,13.24 50.86,13.46 v1(50.86,13.61)
U3_OUT7: length 6
  Top Layer w0.152: v1(51.97,12.67) 52.69,11.95 55.7,11.95 55.91,11.74 LED24.3
  Bottom Layer w0.152: U3.8 51.96,12.65 v1(51.97,12.67)
U3_OUT8: length 8.7
  Top Layer w0.152: v1(56.03,8.41) 56.6,8.41 56.71,8.52 LED24.1
  Bottom Layer w0.152: U3.9 55.54,11.85 56.03,11.37 v1(56.03,8.41)
U3_OUT9: length 8.7
  Top Layer w0.152: LED24.2 55.57,8.95 55.57,7.89 v1(55.48,7.79)
  Bottom Layer w0.152: v1(55.48,7.79) 55.57,7.89 55.57,10.93 55.15,11.35 U3.10
U3_OUT10: length 6.3
  Top Layer w0.152: LED23.1 55.03,8.99 v1(55.03,8.38)
  Bottom Layer w0.152: U3.11 54.51,10.85 55.03,10.34 v1(55.03,8.38)
U3_OUT11: length 5.4
  Top Layer w0.152: LED23.2 53.93,8.86 v1(54.38,8.41)
  Bottom Layer w0.152: U3.12 54.25,10.35 54.38,10.22 v1(54.38,8.41)
U3_OUT12: length 4.5
  Top Layer w0.152: v1(53.72,8.4) 53.62,8.4 53.29,8.74 53.29,9.16 53.16,9.28 LED22.1
  Bottom Layer w0.152: v1(53.72,8.4) 53.72,9.36 53.22,9.86 U3.13
U3_OUT13: length 5.7
  Top Layer w0.152: v1(54.06,7.87) 53.61,7.87 52.96,8.52 52.14,8.52 51.95,8.72
  Bottom Layer w0.152: U3.14 52.96,9.35 53.16,9.16 53.16,8.32 53.53,7.95 53.99,7.95 v1(54.06,7.87)
U3_OUT14: length 9
  Top Layer w0.152: v1(54.7,7.81) 54.31,7.42 53.35,7.42 52.63,8.14 51.33,8.14 50.87,8.6 50.87,9.18 LED21.1
  Bottom Layer w0.152: v1(54.7,7.81) 54.31,7.42 53.5,7.42 52.78,8.14 52.78,8.65 52.57,8.85 U3.15
U3_OUT15: length 3.9
  Top Layer w0.152: LED21.2 49.97,8.92 51.2,7.69 v1(52.2,7.69)
  Bottom Layer w0.152: U3.16 52.2,8.1 v1(52.2,7.69)
U3_OUT16: length 5.5
  Top Layer w0.152: LED20.1 48.79,8.37 49.96,7.2 50.53,7.2 50.95,6.78 51.46,6.78 v1(51.58,6.66)
  Bottom Layer w0.152: U3.17 51.46,7.23 51.46,6.78 v1(51.58,6.66)
U3_OUT17: length 6
  Top Layer w0.152: LED20.2 47.99,8.81 49.85,6.95 50.42,6.95 v1(51.05,6.32)
  Bottom Layer w0.152: 50.62,7.25 50.64,7.22 ; 50.64,7.22 50.99,6.88 50.99,6.38 v1(51.05,6.32) ; 50.64,7.22 U3.18
U3_OUT18: length 6.9
  Top Layer w0.152: v1(50.44,6.13) 50.44,6.28 50.03,6.69 49.75,6.69 48.17,8.27 47.26,8.27 46.8,8.73 LED19.1
  Bottom Layer w0.152: v1(50.44,6.13) 50.44,6.92 50.14,7.22 50.14,7.55
U3_OUT19: length 6.8
  Top Layer w0.152: v1(49.84,6.24) 48.07,8.01 46.81,8.01 46,8.82 LED19.2
  Bottom Layer w0.152: v1(49.84,6.24) 49.84,7.01 49.64,7.21 U3.20
U3_OUT20: length 7.7
  Top Layer w0.152: v1(49.24,6.11) 49.24,6.47 47.95,7.76 46.7,7.76 46.22,8.24 45.93,8.24 45.41,8.75 45.41,9.16 45.28,9.28 LED18.1
  Bottom Layer w0.152: U3.21 49.14,7.2 49.24,7.11 v1(49.24,6.11)
U3_OUT21: length 7.9
  Top Layer w0.152: LED18.2 44.02,8.66 44.16,8.52 45.29,8.52 45.82,7.98 46.12,7.98 46.6,7.5 47.85,7.5 48.63,6.72 v1(48.63,6.19)
  Bottom Layer w0.152: v1(48.63,6.19) 48.63,7.06 48.64,7.07 U3.22
U3_OUT22: length 8.1
  Top Layer w0.152: v1(47.98,6.39) 47.98,7 47.73,7.25 46.49,7.25 46.01,7.73 45.72,7.73 45.18,8.27 43.25,8.27 42.84,8.68 LED17.1
  Bottom Layer w0.152: U3.23 48.14,6.55
U3_OUT23: length 7.8
  Top Layer w0.152: 45.08,8.01 42.75,8.01 42.04,8.72 LED17.2 ; 45.08,8.01 45.61,7.47 45.91,7.47 46.39,6.99 47,6.99 v1(47.38,6.62)
  Bottom Layer w0.152: U3.24 47.38,7.29 v1(47.38,6.62)
U3_SOUT: length 25
  Bottom Layer w0.152: 51.58,5.96 51.63,5.96 ; 51.58,5.96 52.42,6.8 56.26,6.8 56.48,7.01 56.48,9.36 56.33,9.51 56.33,10.43 59.32,13.41 62.37,13.41 62.68,13.09 62.68,11.86 U4.32 ; 51.58,5.96 51.41,5.96 51.19,5.74 50.98,5.74 50.85,5.62 50.33,5.62 50.27,5.56 48.13,5.56 47.75,5.94 47.29,5.94 46.84,6.38 U3.25
U4_IREF: length 2.5
  Bottom Layer w0.152: R4.1 60.57,9.36 U4.27
U4_OUT0: length 7.3
  Top Layer w0.152: 63.08,12.98 63.08,13.16 ; 63.08,13.16 62.63,12.71 60.65,12.71 59.59,11.65 58.3,11.65 57.89,11.25 LED25.3 ; 63.08,13.16 v1(63.14,13.22)
  Bottom Layer w0.152: 63.08,13.22 63.47,12.83 U4.1
U4_OUT1: length 7.3
  Top Layer w0.152: LED26.3 59.87,11.55 60.78,12.46 63.45,12.46 63.59,12.6 63.59,13.71 v1(63.51,13.79)
  Bottom Layer w0.152: U4.2 63.97,13.2 63.51,13.67 v1(63.51,13.79)
U4_OUT2: length 7.2
  Top Layer w0.152: v1(64.18,14.37) 64.1,14.3 64.1,12.35 63.96,12.2 62.3,12.2 61.85,11.75 LED27.3
  Bottom Layer w0.152: v1(64.18,14.37) 64.23,14.32 64.23,13.45 64.47,13.21 U4.3
U4_OUT3: length 4.1
  Top Layer w0.152: v1(64.7,13.62) 64.7,12.43 63.83,11.55 63.83,10.93 LED28.3
  Bottom Layer w0.152: v1(64.7,13.62) 64.97,13.35 U4.4
U4_OUT4: length 3.8
  Top Layer w0.152: v1(65.77,13.6) 65.82,13.55 65.82,10.92
  Bottom Layer w0.152: U4.5 65.47,13.31 v1(65.77,13.6)
U4_OUT5: length 5.9
  Top Layer w0.152: LED30.3 66.31,12.42 v1(66.31,14.34)
  Bottom Layer w0.152: U4.6 65.97,13.1 66.22,13.35 66.22,13.44 66.31,13.53 v1(66.31,14.34)
U4_OUT6: length 5.7
  Top Layer w0.152: v1(66.76,13.6) 66.75,13.58 66.75,12.46 67.24,11.97 68.87,11.97 69.78,11.05 LED31.3
  Bottom Layer w0.152: 66.82,13.33 66.47,12.99 U4.7
U4_OUT7: length 6
  Top Layer w0.152: v1(67.63,12.7) 68,12.33 71.19,12.33 71.76,11.76 LED32.3
  Bottom Layer w0.152: v1(67.63,12.7) 67.58,12.66 U4.8
U4_OUT8: length 8.5
  Top Layer w0.152: LED32.1 72.59,9.26 72.59,8.52 72.46,8.39 v1(72.08,8.39)
  Bottom Layer w0.152: U4.9 71,11.85 72.08,10.77 v1(72.08,8.39)
U4_OUT9: length 7.5
  Top Layer w0.152: 71.45,9.28 LED32.2 71.76,8.83 v1(71.32,8.39)
  Bottom Layer w0.152: U4.10 70.65,11.35 71.32,10.68 v1(71.32,8.39)
U4_OUT10: length 5.9
  Top Layer w0.152: LED31.1 70.69,9.17 v1(70.69,8.38)
  Bottom Layer w0.152: U4.11 69.88,10.85 70.69,10.03 v1(70.69,8.38)
U4_OUT11: length 4.7
  Top Layer w0.152: v1(70.02,8.39) 69.78,8.63 LED31.2
  Bottom Layer w0.152: U4.12 69.11,10.35 70.02,9.44 v1(70.02,8.39)
U4_OUT12: length 4.4
  Top Layer w0.152: LED30.1 68.6,8.58 68.78,8.39 69.37,8.39 v1(69.37,8.4)
  Bottom Layer w0.152: v1(69.37,8.4) 69.37,9.45 68.97,9.86 U4.13
U4_OUT13: length 5.7
  Top Layer w0.152: LED30.2 67.8,8.74 68.68,7.86 v1(69.69,7.86)
  Bottom Layer w0.152: U4.14 68.45,9.36 68.78,9.03 68.78,8.35 69.27,7.86 v1(69.69,7.86)
U4_OUT14: length 8.8
  Top Layer w0.152: v1(70.37,7.85) 69.89,7.38 68.78,7.38 67.89,8.27 67.51,8.27 67.15,8.63 67.15,9.16 67.02,9.28 LED29.1
  Bottom Layer w0.152: U4.15 68.32,8.86 68.45,8.72 68.45,8.14 69.21,7.38 69.89,7.38 v1(70.37,7.85)
U4_OUT15: length 4.9
  Top Layer w0.152: v1(68.21,7.31) 68.11,7.31 67.03,8.38 66,8.38 65.82,8.56 65.82,9.28
  Bottom Layer w0.152: U4.16 68.21,7.92 v1(68.21,7.31)
U4_OUT16: length 5.8
  Top Layer w0.152: v1(67.32,6.3) 66.24,7.38 65.67,7.38 64.64,8.41 LED28.1
  Bottom Layer w0.152: v1(67.32,6.3) 67,6.61 67,7.53 U4.17
U4_OUT17: length 6.3
  Top Layer w0.152: LED28.2 63.84,8.64 65.35,7.12 66.11,7.12 66.68,6.56 v1(66.68,6.14)
  Bottom Layer w0.152: U4.18 66.49,7.53 66.49,6.32 v1(66.68,6.14)
U4_OUT18: length 6.7
  Top Layer w0.152: v1(66.05,6) 63.66,8.39 63.32,8.39 63.21,8.5 63.21,9.16 63.08,9.28 LED27.1
  Bottom Layer w0.152: U4.19 65.97,6.08 v1(66.05,6)
U4_OUT19: length 7.3
  Top Layer w0.152: LED27.2 61.85,8.74 62.45,8.14 63.45,8.14 65.32,6.27 v1(65.32,5.8)
  Bottom Layer w0.152: U4.20 65.47,5.96 v1(65.32,5.8)
U4_OUT20: length 8
  Top Layer w0.152: LED26.1 61.16,9.28 61.29,9.16 61.29,8.52 61.92,7.88 63.34,7.88 64.72,6.51 v1(64.72,5.85)
  Bottom Layer w0.152: v1(64.72,5.85) 64.72,6.23 64.97,6.49 U4.21
U4_OUT21: length 8.1
  Top Layer w0.152: v1(64.08,5.98) 64.08,6.78 63.23,7.63 61.82,7.63 60.93,8.52 60.14,8.52 59.87,8.79 LED26.2
  Bottom Layer w0.152: v1(64.08,5.98) 64.47,6.37 U4.22
U4_OUT22: length 8.3
  Top Layer w0.152: v1(63.51,6.3) 63.51,6.99 63.13,7.38 61.71,7.38 60.82,8.27 59,8.27 58.69,8.58 LED25.1
  Bottom Layer w0.152: v1(63.51,6.3) 63.97,6.76 U4.23
U4_OUT23: length 8
  Top Layer w0.152: LED25.2 57.86,9.25 57.86,8.52 58.37,8.01 60.72,8.01 61.61,7.12 62.43,7.12 v1(62.94,6.62)
  Bottom Layer w0.152: v1(62.94,6.62) 63.19,6.62 63.47,6.9 U4.24
WS2812_OUTPUT: length 6.3
  Top Layer w0.305: CEM1.B8 6.27,12.56 6.42,12.71 6.42,13.22 6.08,13.56 CEM1.B7

## Copper pours and planes (outline as drawn; the poured copper is in the pictures)
GND on Top Layer: 6.93,24.65 81.61,24.65 81.61,-5.58 6.93,-5.58
GND on Bottom Layer: 6.93,25.67 82.88,25.67 82.88,-7.61 6.93,-7.61
